# Altium schematic sheet 3_IO.schdoc
size 426 x 302 mm; Symbol: Sheet_A3; Device: Sheet_A3; @Project Name: Yuzuki Chameleon 基于H616的卡片电脑; REV: 1.0; Date: 2022-03-08; Sheet: 1/1; Draw By: GloomyGhost; Company: Your Company; @Update Date: 2025-03-02; @Page Count: 4; @Page No: 3; SheetNumber: 3; SheetTotal: 4
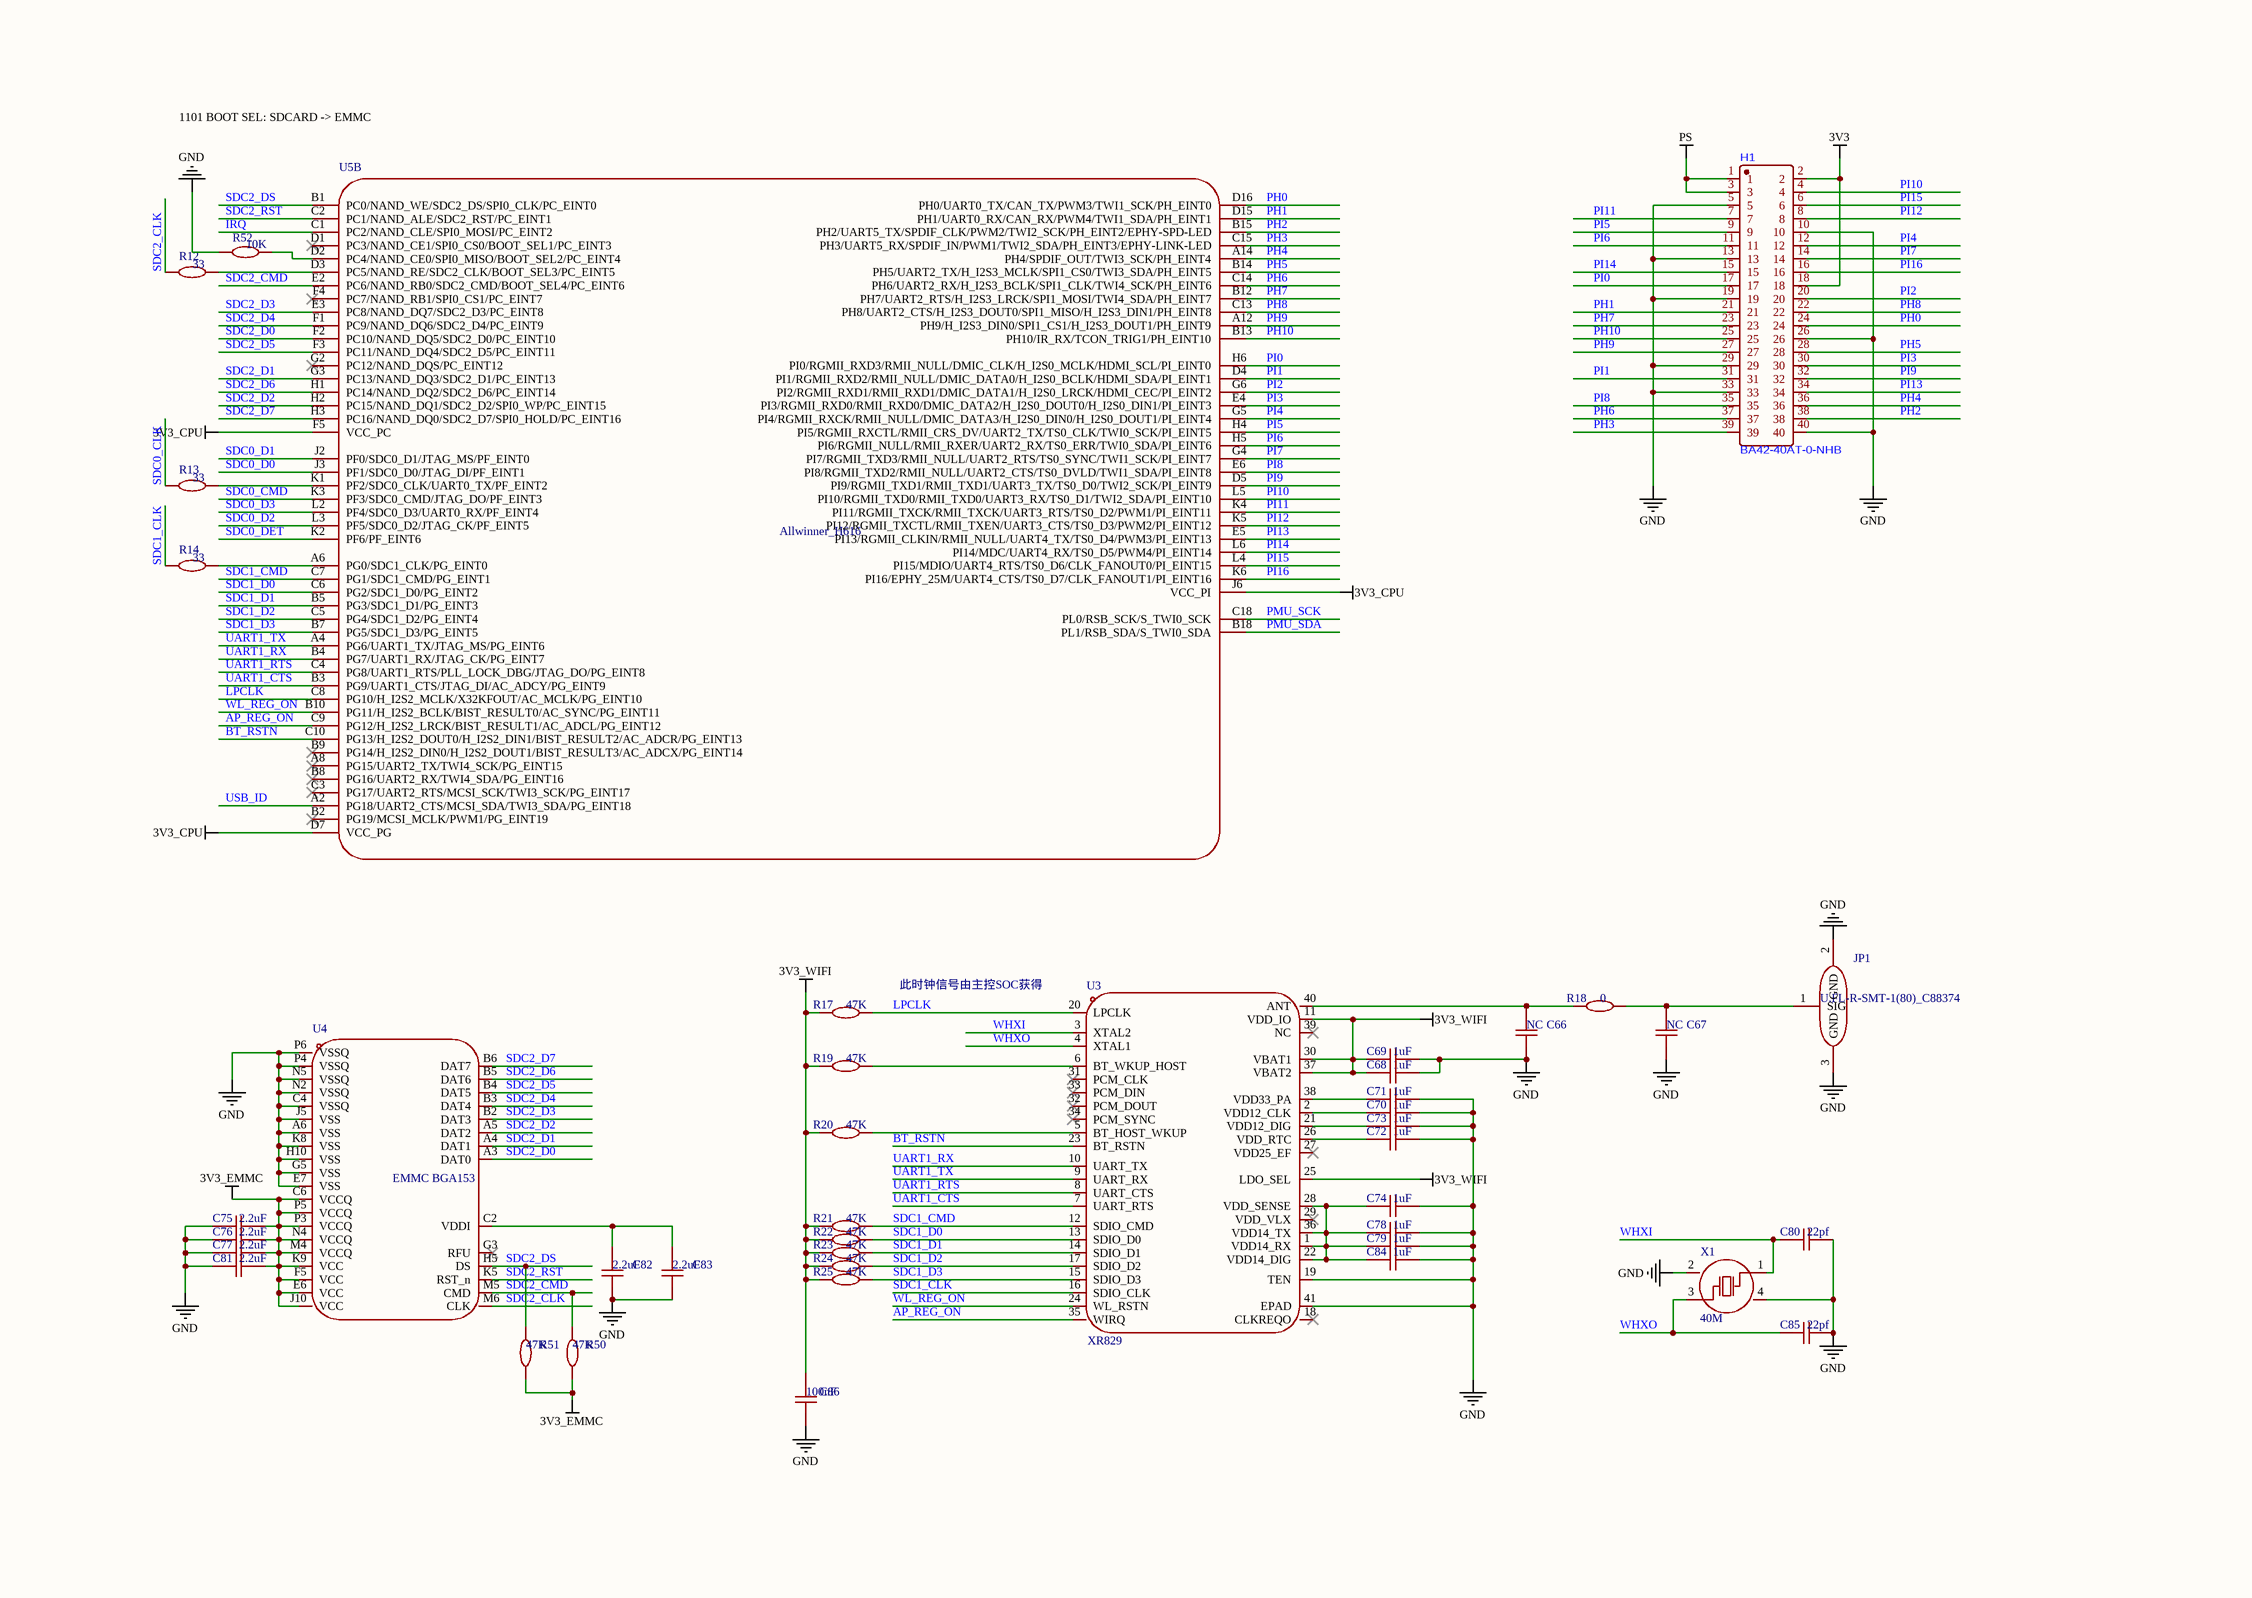
[diagram p0: 3_IO.schdoc]

## Parts
C66  NC  [C0402]
C67  NC  [C0402]
C68  1uF  [C0402]
C69  1uF  [C0402]
C70  1uF  [C0402]
C71  1uF  [C0402]
C72  1uF  [C0402]
C73  1uF  [C0402]
C74  1uF  [C0402]
C75  2.2uF  [C0402]
C76  2.2uF  [C0402]
C77  2.2uF  [C0402]
C78  1uF  [C0402]
C79  1uF  [C0402]
C80  22pf  [C0402]
C81  2.2uF  [C0402]
C82  2.2uF  [C0402]
C83  2.2uF  [C0402]
C84  1uF  [C0402]
C85  22pf  [C0402]
C86  100nF  [c0402-nsk_1]
H1  BA42-40AT-0-NHB  [CONN-SMD_40P-P0.80_10144517-042802LF]
JP1  U.FL-R-SMT-1(80)_C88374  [RF-SMD_FRF05002-JSS103M]
R12  33  [R0402-NSK_2]
R13  33  [R0402-NSK_2]
R14  33  [R0402-NSK_2]
R17  47K  [R0402-NSK_2]
R18  0  [R0402-NSK_2]
R19  47K  [R0402-NSK_2]
R20  47K  [R0402-NSK_2]
R21  47K  [R0402-NSK_2]
R22  47K  [R0402-NSK_2]
R23  47K  [R0402-NSK_2]
R24  47K  [R0402-NSK_2]
R25  47K  [R0402-NSK_2]
R50  47K  [R0402-NSK_2]
R51  47K  [R0402-NSK_2]
R52  10K  [R0402-NSK_2]
U3  XR829  [QFN-40_L5.0-W5.0-P0.40-BL-EP3.4]
U4  EMMC BGA153  [FBGA-153_L13.0-W11.5]
U5  Allwinner_H616  [BGA284P65B1200_1400H125]  (part B of 4)
X1  40M  [OSC-SMD_4P-L2.0-W1.6-BL]

## Nets
3V3: H1.2 H1.18
3V3_CPU: U5.D7(VCC_PG) U5.F5(VCC_PC) U5.J6(VCC_PI)
3V3_EMMC: C75.2 C76.2 C77.2 C81.2 R50.1 R51.1 U4.C6(VCCQ) U4.E6(VCC) U4.F5(VCC) U4.J10(VCC) U4.K9(VCC) U4.M4(VCCQ) U4.N4(VCCQ) U4.P3(VCCQ) U4.P5(VCCQ)
3V3_WIFI: C68.1 C69.1 C86.2 R17.1 R19.1 R20.1 R21.1 R22.1 R23.1 R24.1 R25.1 U3.11(VDD_IO) U3.25(LDO_SEL) U3.30(VBAT1) U3.37(VBAT2)
GND: C66.1 C67.1 C68.2 C69.2 C70.2 C71.2 C72.2 C73.2 C74.2 C75.1 C76.1 C77.1 C78.2 C79.2 C80.2 C81.1 C82.1 C83.1 C84.2 C85.2 C86.1 H1.5 H1.10 H1.13 H1.19 H1.26 H1.29 H1.33 H1.40 JP1.2(GND) JP1.3(GND) R52.2 U3.19(TEN) U3.41(EPAD) U4.A6(VSS) U4.C4(VSSQ) U4.E7(VSS) U4.G5(VSS) U4.H10(VSS) U4.J5(VSS) U4.K8(VSS) U4.N2(VSSQ) U4.N5(VSSQ) U4.P4(VSSQ) U4.P6(VSSQ) X1.2(GND) X1.4(GND)
PS: H1.1 H1.3
AP_REG_ON: U3.35(WIRQ) U5.C9(PG12/H_I2S2_LRCK/BIST_RESULT1/AC_ADCL/PG_EINT12)
BT_RSTN: U3.23(BT_RSTN) U5.C10(PG13/H_I2S2_DOUT0/H_I2S2_DIN1/BIST_RESULT2/AC_ADCR/PG_EINT13)
IRQ: U5.C1(PC2/NAND_CLE/SPI0_MOSI/PC_EINT2)
LPCLK: R17.2 U3.20(LPCLK) U5.C8(PG10/H_I2S2_MCLK/X32KFOUT/AC_MCLK/PG_EINT10)
PH0: H1.24 U5.D16(PH0/UART0_TX/CAN_TX/PWM3/TWI1_SCK/PH_EINT0)
PH1: H1.21 U5.D15(PH1/UART0_RX/CAN_RX/PWM4/TWI1_SDA/PH_EINT1)
PH2: H1.38 U5.B15(PH2/UART5_TX/SPDIF_CLK/PWM2/TWI2_SCK/PH_EINT2/EPHY-SPD-LED)
PH3: H1.39 U5.C15(PH3/UART5_RX/SPDIF_IN/PWM1/TWI2_SDA/PH_EINT3/EPHY-LINK-LED)
PH4: H1.36 U5.A14(PH4/SPDIF_OUT/TWI3_SCK/PH_EINT4)
PH5: H1.28 U5.B14(PH5/UART2_TX/H_I2S3_MCLK/SPI1_CS0/TWI3_SDA/PH_EINT5)
PH6: H1.37 U5.C14(PH6/UART2_RX/H_I2S3_BCLK/SPI1_CLK/TWI4_SCK/PH_EINT6)
PH7: H1.23 U5.B12(PH7/UART2_RTS/H_I2S3_LRCK/SPI1_MOSI/TWI4_SDA/PH_EINT7)
PH8: H1.22 U5.C13(PH8/UART2_CTS/H_I2S3_DOUT0/SPI1_MISO/H_I2S3_DIN1/PH_EINT8)
PH9: H1.27 U5.A12(PH9/H_I2S3_DIN0/SPI1_CS1/H_I2S3_DOUT1/PH_EINT9)
PH10: H1.25 U5.B13(PH10/IR_RX/TCON_TRIG1/PH_EINT10)
PI0: H1.17 U5.H6(PI0/RGMII_RXD3/RMII_NULL/DMIC_CLK/H_I2S0_MCLK/HDMI_SCL/PI_EINT0)
PI1: H1.31 U5.D4(PI1/RGMII_RXD2/RMII_NULL/DMIC_DATA0/H_I2S0_BCLK/HDMI_SDA/PI_EINT1)
PI2: H1.20 U5.G6(PI2/RGMII_RXD1/RMII_RXD1/DMIC_DATA1/H_I2S0_LRCK/HDMI_CEC/PI_EINT2)
PI3: H1.30 U5.E4(PI3/RGMII_RXD0/RMII_RXD0/DMIC_DATA2/H_I2S0_DOUT0/H_I2S0_DIN1/PI_EINT3)
PI4: H1.12 U5.G5(PI4/RGMII_RXCK/RMII_NULL/DMIC_DATA3/H_I2S0_DIN0/H_I2S0_DOUT1/PI_EINT4)
PI5: H1.9 U5.H4(PI5/RGMII_RXCTL/RMII_CRS_DV/UART2_TX/TS0_CLK/TWI0_SCK/PI_EINT5)
PI6: H1.11 U5.H5(PI6/RGMII_NULL/RMII_RXER/UART2_RX/TS0_ERR/TWI0_SDA/PI_EINT6)
PI7: H1.14 U5.G4(PI7/RGMII_TXD3/RMII_NULL/UART2_RTS/TS0_SYNC/TWI1_SCK/PI_EINT7)
PI8: H1.35 U5.E6(PI8/RGMII_TXD2/RMII_NULL/UART2_CTS/TS0_DVLD/TWI1_SDA/PI_EINT8)
PI9: H1.32 U5.D5(PI9/RGMII_TXD1/RMII_TXD1/UART3_TX/TS0_D0/TWI2_SCK/PI_EINT9)
PI10: H1.4 U5.L5(PI10/RGMII_TXD0/RMII_TXD0/UART3_RX/TS0_D1/TWI2_SDA/PI_EINT10)
PI11: H1.7 U5.K4(PI11/RGMII_TXCK/RMII_TXCK/UART3_RTS/TS0_D2/PWM1/PI_EINT11)
PI12: H1.8 U5.K5(PI12/RGMII_TXCTL/RMII_TXEN/UART3_CTS/TS0_D3/PWM2/PI_EINT12)
PI13: H1.34 U5.E5(PI13/RGMII_CLKIN/RMII_NULL/UART4_TX/TS0_D4/PWM3/PI_EINT13)
PI14: H1.15 U5.L6(PI14/MDC/UART4_RX/TS0_D5/PWM4/PI_EINT14)
PI15: H1.6 U5.L4(PI15/MDIO/UART4_RTS/TS0_D6/CLK_FANOUT0/PI_EINT15)
PI16: H1.16 U5.K6(PI16/EPHY_25M/UART4_CTS/TS0_D7/CLK_FANOUT1/PI_EINT16)
PMU_SCK: U5.C18(PL0/RSB_SCK/S_TWI0_SCK)
PMU_SDA: U5.B18(PL1/RSB_SDA/S_TWI0_SDA)
SDC0_CLK: R13.1
SDC0_CMD: U5.K3(PF3/SDC0_CMD/JTAG_DO/PF_EINT3)
SDC0_D0: U5.J3(PF1/SDC0_D0/JTAG_DI/PF_EINT1)
SDC0_D1: U5.J2(PF0/SDC0_D1/JTAG_MS/PF_EINT0)
SDC0_D2: U5.L3(PF5/SDC0_D2/JTAG_CK/PF_EINT5)
SDC0_D3: U5.L2(PF4/SDC0_D3/UART0_RX/PF_EINT4)
SDC0_DET: U5.K2(PF6/PF_EINT6)
SDC1_CLK: R14.1 U3.16(SDIO_CLK)
SDC1_CMD: R21.2 U3.12(SDIO_CMD) U5.C7(PG1/SDC1_CMD/PG_EINT1)
SDC1_D0: R22.2 U3.13(SDIO_D0) U5.C6(PG2/SDC1_D0/PG_EINT2)
SDC1_D1: R23.2 U3.14(SDIO_D1) U5.B5(PG3/SDC1_D1/PG_EINT3)
SDC1_D2: R24.2 U3.17(SDIO_D2) U5.C5(PG4/SDC1_D2/PG_EINT4)
SDC1_D3: R25.2 U3.15(SDIO_D3) U5.B7(PG5/SDC1_D3/PG_EINT5)
SDC2_CLK: R12.1 U4.M6(CLK)
SDC2_CMD: R50.2 U4.M5(CMD) U5.E2(PC6/NAND_RB0/SDC2_CMD/BOOT_SEL4/PC_EINT6)
SDC2_D0: U4.A3(DAT0) U5.F2(PC10/NAND_DQ5/SDC2_D0/PC_EINT10)
SDC2_D1: U4.A4(DAT1) U5.G3(PC13/NAND_DQ3/SDC2_D1/PC_EINT13)
SDC2_D2: U4.A5(DAT2) U5.H2(PC15/NAND_DQ1/SDC2_D2/SPI0_WP/PC_EINT15)
SDC2_D3: U4.B2(DAT3) U5.E3(PC8/NAND_DQ7/SDC2_D3/PC_EINT8)
SDC2_D4: U4.B3(DAT4) U5.F1(PC9/NAND_DQ6/SDC2_D4/PC_EINT9)
SDC2_D5: U4.B4(DAT5) U5.F3(PC11/NAND_DQ4/SDC2_D5/PC_EINT11)
SDC2_D6: U4.B5(DAT6) U5.H1(PC14/NAND_DQ2/SDC2_D6/PC_EINT14)
SDC2_D7: U4.B6(DAT7) U5.H3(PC16/NAND_DQ0/SDC2_D7/SPI0_HOLD/PC_EINT16)
SDC2_DS: R51.2 U4.H5(DS) U5.B1(PC0/NAND_WE/SDC2_DS/SPI0_CLK/PC_EINT0)
SDC2_RST: U4.K5(RST_n) U5.C2(PC1/NAND_ALE/SDC2_RST/PC_EINT1)
UART1_CTS: U3.7(UART_RTS) U5.B3(PG9/UART1_CTS/JTAG_DI/AC_ADCY/PG_EINT9)
UART1_RTS: U3.8(UART_CTS) U5.C4(PG8/UART1_RTS/PLL_LOCK_DBG/JTAG_DO/PG_EINT8)
UART1_RX: U3.10(UART_TX) U5.B4(PG7/UART1_RX/JTAG_CK/PG_EINT7)
UART1_TX: U3.9(UART_RX) U5.A4(PG6/UART1_TX/JTAG_MS/PG_EINT6)
USB_ID: U5.A2(PG18/UART2_CTS/MCSI_SDA/TWI3_SDA/PG_EINT18)
WHXI: C80.1 U3.3(XTAL2) X1.1(OSC1)
WHXO: C85.1 U3.4(XTAL1) X1.3(OSC2)
WL_REG_ON: U3.24(WL_RSTN) U5.B10(PG11/H_I2S2_BCLK/BIST_RESULT0/AC_SYNC/PG_EINT11)
NetC66_2: C66.2 R18.1 U3.40(ANT)
NetC67_2: C67.2 JP1.1(SIG) R18.2
NetC70_1: C70.1 U3.2(VDD12_CLK)
NetC71_1: C71.1 U3.38(VDD33_PA)
NetC72_1: C72.1 U3.26(VDD_RTC)
NetC73_1: C73.1 U3.21(VDD12_DIG)
NetC74_1: C74.1 C78.1 C79.1 C84.1 U3.1(VDD14_RX) U3.22(VDD14_DIG) U3.28(VDD_SENSE) U3.36(VDD14_TX)
NetC82_2: C82.2 C83.2 U4.C2(VDDI)
NetR12_2: R12.2 U5.D3(PC5/NAND_RE/SDC2_CLK/BOOT_SEL3/PC_EINT5)
NetR13_2: R13.2 U5.K1(PF2/SDC0_CLK/UART0_TX/PF_EINT2)
NetR14_2: R14.2 U5.A6(PG0/SDC1_CLK/PG_EINT0)
NetR19_2: R19.2 U3.6(BT_WKUP_HOST)
NetR20_2: R20.2 U3.5(BT_HOST_WKUP)
NetR52_1: R52.1 U5.D2(PC4/NAND_CE0/SPI0_MISO/BOOT_SEL2/PC_EINT4)

Not connected (* = marked no-connect by the designer): U3 18(CLKREQO)* 27(VDD25_EF)* 29(VDD_VLX)* 31(PCM_CLK)* 32(PCM_DOUT)* 33(PCM_DIN)* 34(PCM_SYNC)* 39(NC)*; U4 G3(RFU)*; U5 A8(PG15/UART2_TX/TWI4_SCK/PG_EINT15)* B2(PG19/MCSI_MCLK/PWM1/PG_EINT19)* B8(PG16/UART2_RX/TWI4_SDA/PG_EINT16)* B9(PG14/H_I2S2_DIN0/H_I2S2_DOUT1/BIST_RESULT3/AC_ADCX/PG_EINT14)* C3(PG17/UART2_RTS/MCSI_SCK/TWI3_SCK/PG_EINT17)* D1(PC3/NAND_CE1/SPI0_CS0/BOOT_SEL1/PC_EINT3)* F4(PC7/NAND_RB1/SPI0_CS1/PC_EINT7)* G2(PC12/NAND_DQS/PC_EINT12)*

## Notes on the sheet
- 1101 BOOT SEL: SDCARD -> EMMC
- (near R17) 此时钟信号由主控SOC获得
- 1
- 2
- 3
- 4
- 5
- 6
- 7
- 8
- A
- B
- C
- D
- E
- TITLE:
- Yuzuki Chameleon 基于H616的卡片电脑
- REV:
- 1.0
- Date:
- Company:
- 2022-03-08
- Your Company
- Drawn By:
- GloomyGhost
- Sheet:
- 1/1

## Library data of the parts
C66-C85 = CAP_0402
C86 = FN15X104K250PNG
R12-R14 R17-R25 R50-R52 = Res_0402
X1 = SX32Y024000BC1T